# Altium project ESP32.PrjPcb
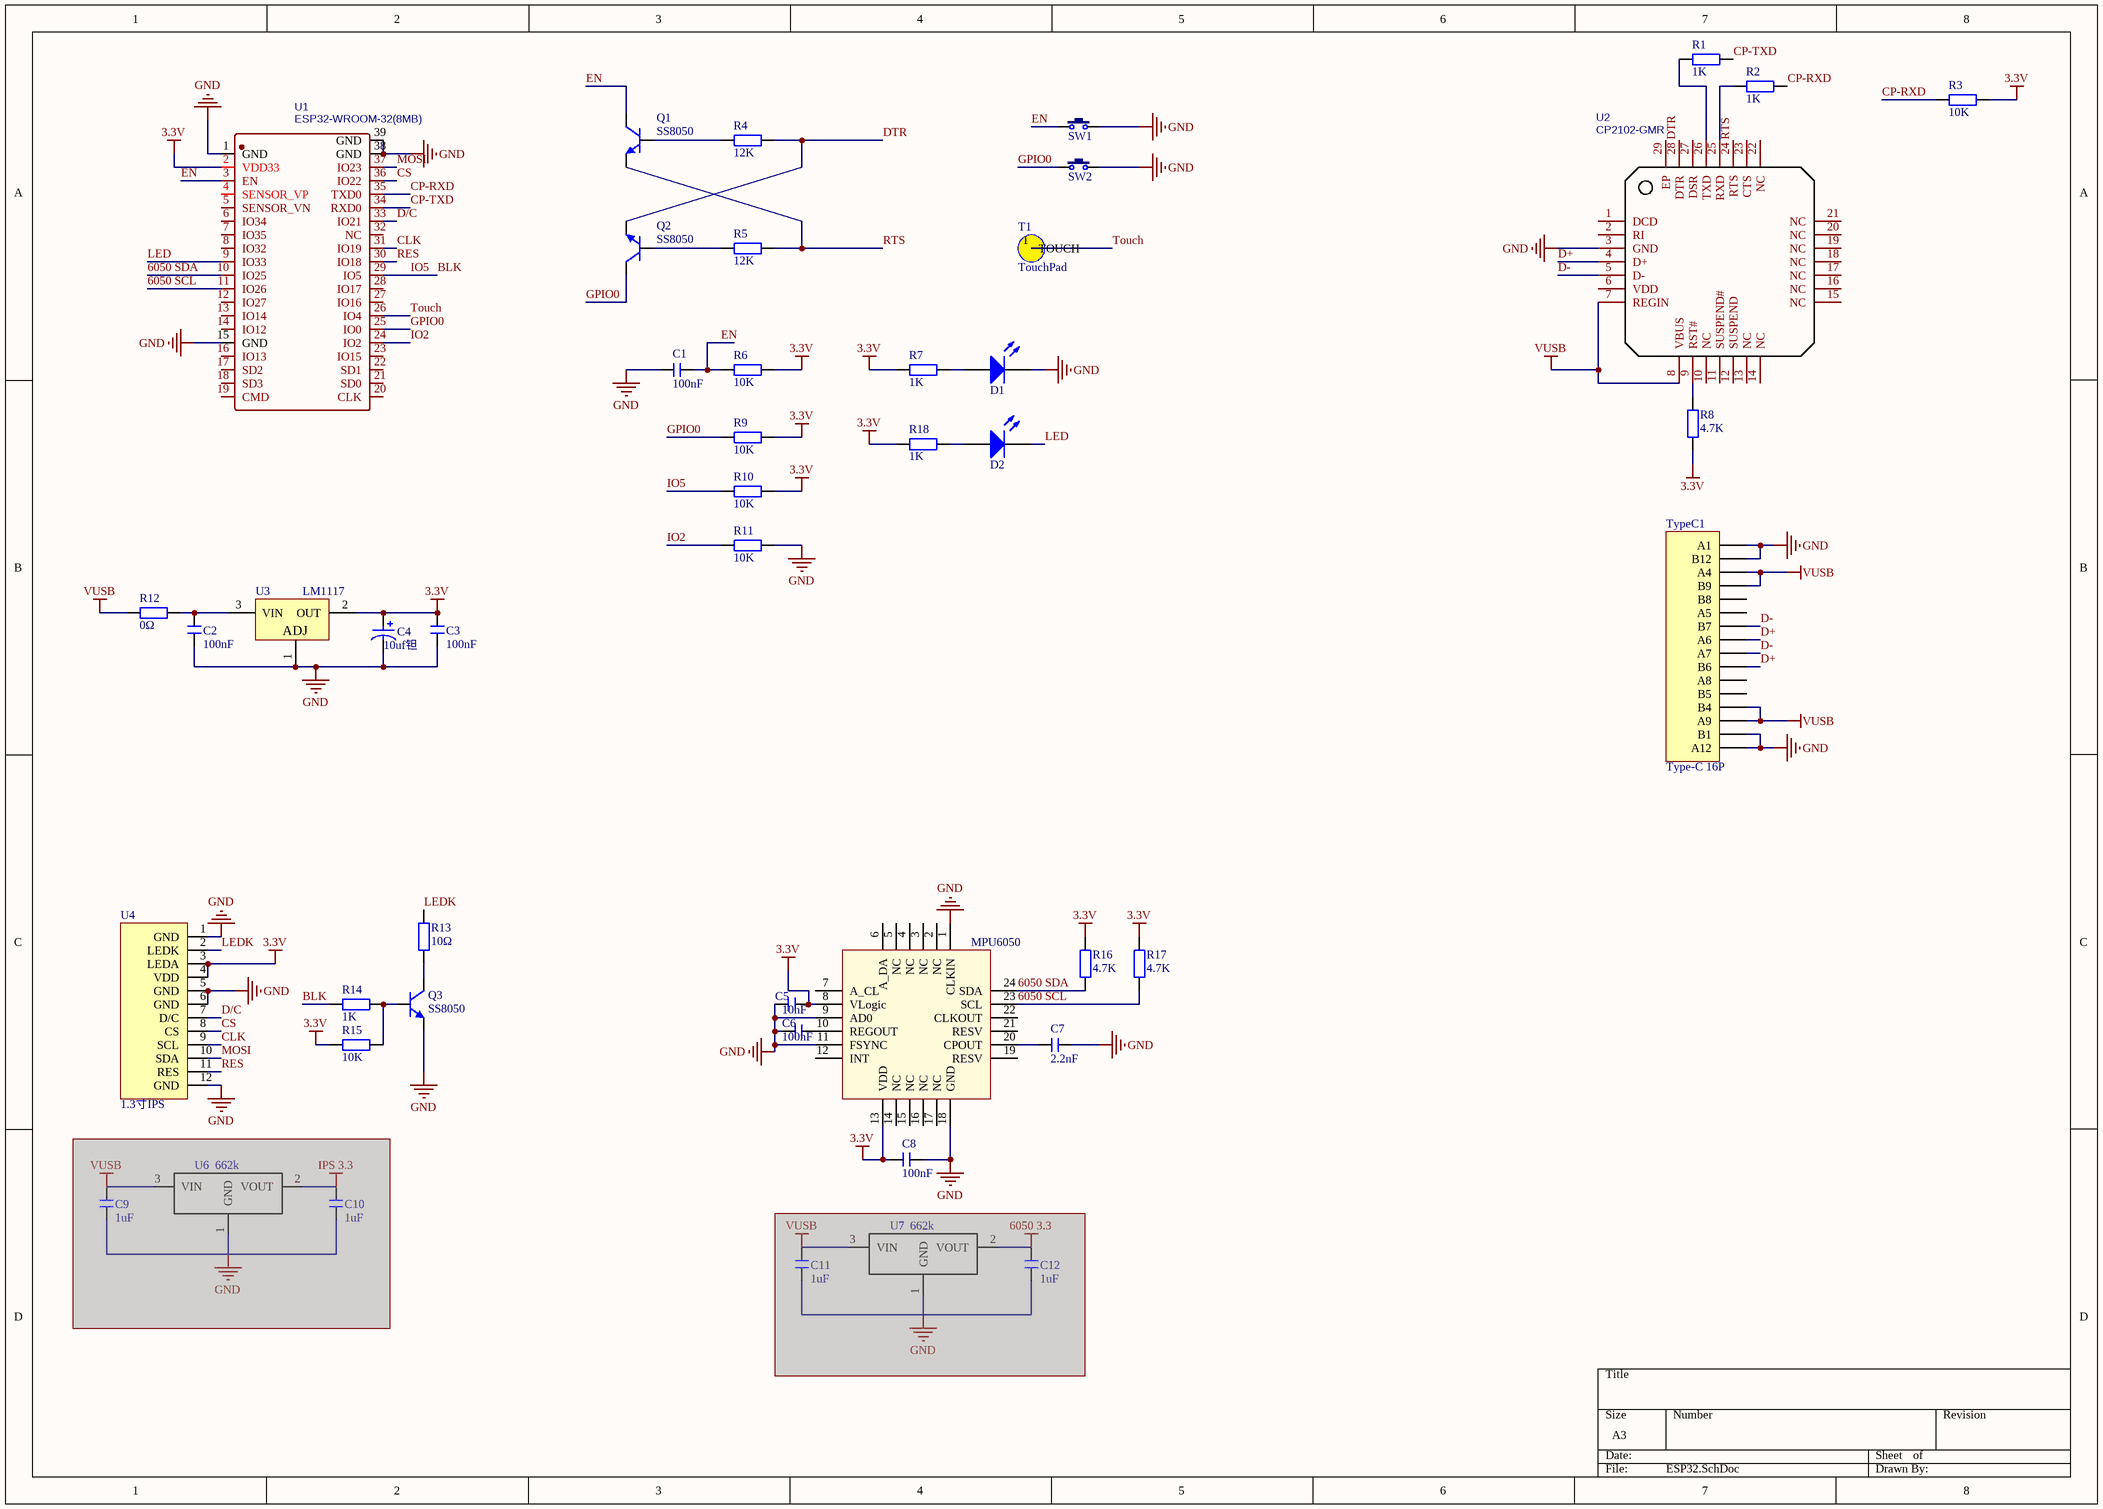
[diagram p0: ESP32.SchDoc]
1 sheet, 46 parts. Net scope: global (net labels, ports and power ports of the same name join across sheets).
Board file: ESP32.PcbDoc

## Sheet ESP32.SchDoc
size A3

### Parts
C1  100nF  [C0603]
C2  100nF  [C0603]
C3  100nF  [C0603]
C4  10uf钽  [C1206A]
C5  10nF  [C0603]
C6  100nF  [C0603]
C7  2.2nF  [C0603]
C8  100nF  [C0603]
C9  1uF  [C0603]  (masked out: inside a compile mask, not in the netlist)
C10  1uF  [C0603]  (masked out: inside a compile mask, not in the netlist)
C11  1uF  [C0603]  (masked out: inside a compile mask, not in the netlist)
C12  1uF  [C0603]  (masked out: inside a compile mask, not in the netlist)
D1  LED  [0603LED_RED]  (value not drawn)
D2  LED  [0603LED_RED]  (value not drawn)
Q1  SS8050  [SOT23-3N]
Q2  SS8050  [SOT23-3N]
Q3  SS8050  [SOT23-3N]
R1  1K  [R0603]
R2  1K  [R0603]
R3  10K  [R0603]
R4  12K  [R0603]
R5  12K  [R0603]
R6  10K  [R0603]
R7  1K  [R0603]
R8  4.7K  [R0603]
R9  10K  [R0603]
R10  10K  [R0603]
R11  10K  [R0603]
R12  0Ω  [R0603]
R13  10Ω  [R0603]
R14  1K  [R0603]
R15  10K  [R0603]
R16  4.7K  [R0603]
R17  4.7K  [R0603]
R18  1K  [R0603]
SW1  3x6x5  [龟仔微动]  (value not drawn)
SW2  3x6x5  [龟仔微动]  (value not drawn)
T1  TouchPad  [TouchPad]
TypeC1  Type-C 16P  [typec]
U1  ESP32-WROOM-32(8MB)  [ESP32MOUDLE]
U2  CP2102-GMR  [QFN28]
U3  LM1117  [SOT-223]
U4  1.3寸IPS  [1.3寸IPS]
U5  MPU6050  [QFN24]
U6  662k  [SOT23-3N]  (masked out: inside a compile mask, not in the netlist)
U7  662k  [SOT23-3N]  (masked out: inside a compile mask, not in the netlist)

### Nets
3.3V: C3.2 C4.1 C5.2 C8.2 R3.2 R6.2 R7.1 R8.1 R9.2 R10.2 R15.1 R16.2 R17.2 R18.1 U1.2(VDD33) U3.2(OUT) U4.3(LEDA) U4.4(VDD) U5.8(VLogic) U5.13(VDD)
GND: C1.1 C2.1 C3.1 C4.2 C5.1 C6.2 C7.2 C8.1 D1.2(K) Q3.2(E) R11.2 SW1.2 SW2.2 TypeC1.A1 TypeC1.A12 TypeC1.B1 TypeC1.B12 U1.1(GND) U1.15(GND) U1.38(GND) U1.39(GND) U2.3(GND) U3.1(ADJ) U4.1(GND) U4.5(GND) U4.6(GND) U4.12(GND) U5.1(CLKIN) U5.9(AD0) U5.11(FSYNC) U5.18(GND)
VUSB: R12.1 TypeC1.A4 TypeC1.A9 TypeC1.B4 TypeC1.B9 U2.7(REGIN) U2.8(VBUS)
6050 SCL: R17.1 U1.11(IO26) U5.23(SCL)
6050 SDA: R16.1 U1.10(IO25) U5.24(SDA)
BLK: R10.1 R14.1 U1.29(IO5)  [also labelled IO5]
CLK: U1.31(IO19) U4.9(SCL)
CP-RXD: R2.2 R3.1 U1.35(TXD0)
CP-TXD: R1.2 U1.34(RXD0)
CS: U1.36(IO22) U4.8(CS)
D+: TypeC1.A6 TypeC1.B6 U2.4(D+)
D-: TypeC1.A7 TypeC1.B7 U2.5(D-)
D/C: U1.33(IO21) U4.7(D/C)
DTR: Q2.2(E) R4.2 U2.28(DTR)
EN: C1.2 Q1.3(C) R6.1 SW1.1 U1.3(EN)
GPIO0: Q2.3(C) R9.1 SW2.1 U1.25(IO0)
IO2: R11.1 U1.24(IO2)
LED: D2.2(K) U1.9(IO33)
LEDK: R13.2 U4.2(LEDK)
MOSI: U1.37(IO23) U4.10(SDA)
RES: U1.30(IO18) U4.11(RES)
RTS: Q1.2(E) R5.2 U2.24(RTS)
Touch: T1.1(TOUCH) U1.26(IO4)
NetC2_2: C2.2 R12.2 U3.3(VIN)
NetC6_1: C6.1 U5.10(REGOUT)
NetC7_1: C7.1 U5.20(CPOUT)
NetD1_1: D1.1(A) R7.2
NetD2_1: D2.1(A) R18.2
NetQ1_1: Q1.1(B) R4.1
NetQ2_1: Q2.1(B) R5.1
NetQ3_1: Q3.1(B) R14.2 R15.2
NetQ3_3: Q3.3(C) R13.1
NetR1_1: R1.1 U2.26(TXD)
NetR2_1: R2.1 U2.25(RXD)
NetR8_2: R8.2 U2.9(RST#)

Not connected (* = marked no-connect by the designer): TypeC1 A5 A8 B5 B8; U1 4(SENSOR_VP) 5(SENSOR_VN) 6(IO34) 7(IO35) 8(IO32) 12(IO27) 13(IO14) 14(IO12) 16(IO13) 17(SD2) 18(SD3) 19(CMD) 20(CLK) 21(SD0) 22(SD1) 23(IO15) 27(IO16) 28(IO17) 32(NC); U2 1(DCD) 2(RI) 6(VDD) 10(NC) 11(SUSPEND#) 12(SUSPEND) 13(NC) 14(NC) 15(NC) 16(NC) 17(NC) 18(NC) 19(NC) 20(NC) 21(NC) 22(NC) 23(CTS) 27(DSR) 29(EP); U5 2(NC) 3(NC) 4(NC) 5(NC) 6(A_DA) 7(A_CL) 12(INT) 14(NC) 15(NC) 16(NC) 17(NC) 19(RESV) 21(RESV) 22(CLKOUT)

### Library data of the parts
C1-C3 C5-C12 = C: 无极性贴片电容; 版权归属: 源创客; BOM名称: 无极性贴片电容; 学习资源: www.ooocke.com
C4 = Cap pol: 大电解; name: C？; value: 10uf钽
D1 D2 = LED: Typical RED, GREEN, YELLOW, AMBER GaAs LED; Published: 8-Jun-2000; LatestRevisionDate: 17-Jul-2002; LatestRevisionNote: Re-released for DXP Platform.; PackageDocument: Feb-2002; PackageReference: 3.2X1.6X1.1; Publisher: Altium Limited
Q1-Q3 = 8050-SMD: 高频放大-NPN型; 版权归属: 源创客; 属性: 40V 1.5A 1W 100MHZ; BOM名称: 高频放大-NPN型; 学习资源: www.ooocke.com
R1-R18 = R: 贴片电阻; 版权归属: 源创客; BOM名称: 贴片电阻; 学习资源: www.ooocke.com
SW1 SW2 = TSW 3x6: 3x6轻触开关; 版权归属: 源创客; BOM名称: 3x6轻触开关; 学习资源: www.ooocke.com
T1 = T?
TypeC1 = Type-c-16P
U1 = ESP32-WROOM-32(8MB): BOM_Manufacturer: Espressif Systems; Contributor: LCSC; BOM_Supplier: LCSC; BOM_Supplier Part: C529582; BOM_Manufacturer Part: ESP32-WROOM-32(8MB); BOM_JLCPCB Part Class: Extended Part; spicePre: U; spiceSymbolName: ESP32-WROOM-32(8MB)
U2 = CP2102-GMR: BOM_Manufacturer: SILICON LABS; BOM_Supplier: LCSC; BOM_Manufacturer Part: CP2102-GMR; BOM_Supplier Part: C6568; BOM_JLCPCB Part Class: Basic Part; spicePre: U; spiceSymbolName: CP2102-GMR
U3 = LM1117: 5V 3V3
U4 = 1.3IPS
U5 = MPU6050: 六轴传感器
U6 U7 = 662k: 5.0V -> 3.3V